# Altium schematic sheet vme_full_bus.SchDoc
size A4
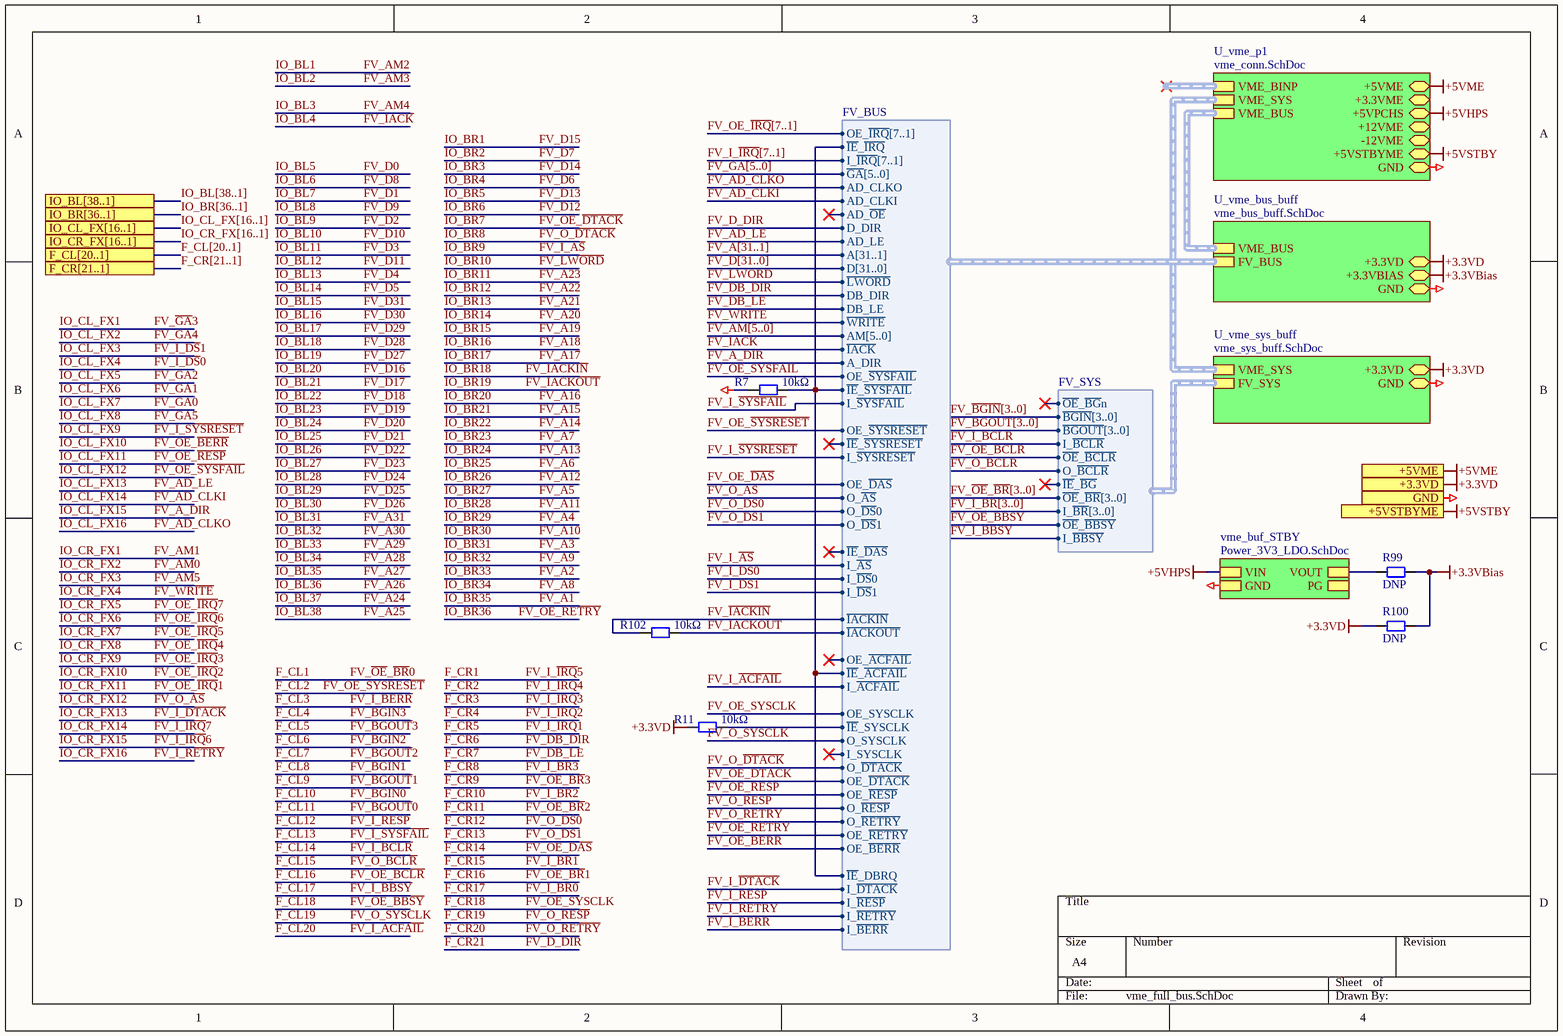
[diagram p0: vme_full_bus.SchDoc]

## Parts
R7  10kΩ  [RESC2012N]
R11  10kΩ  [RESC2012N]
R99  DNP  [RESC2012N]
R100  DNP  [RESC2012N]
R102  10kΩ  [RESC2012N]

## Sub-sheets
U_vme_bus_buff = vme_bus_buff.SchDoc: GND (bidir), +3.3VBIAS (bidir), +3.3VD (bidir), FV_BUS (harness FV_BUS), VME_BUS (harness VME_BUS)
U_vme_p1 = vme_conn.SchDoc: VME_BINP (harness VME_BINP), VME_SYS (harness VME_SYS), +5VSTBYME (bidir), +12VME (bidir), -12VME (bidir), +5VPCHS (bidir), +3.3VME (bidir), VME_BUS (harness VME_BUS), +5VME (bidir), GND (bidir)
U_vme_sys_buff = vme_sys_buff.SchDoc: VME_SYS (harness VME_SYS), +3.3VD (bidir), GND (bidir), FV_SYS (harness FV_SYS)
vme_buf_STBY = Power_3V3_LDO.SchDoc: GND, VOUT, VIN, PG

## Ports
+3.3VD, +5VME, +5VSTBYME, F_CL[20..1], F_CR[21..1], GND, IO_BL[38..1], IO_BR[36..1], IO_CL_FX[16..1], IO_CR_FX[16..1]

## Harnesses
FV_SYS: ~{OE}_~{BG}n, ~{BGIN}[3..0], ~{BGOUT}[3..0], I_~{BCLR}, ~{OE}_~{BCLR}, O_~{BCLR}, ~{IE}_~{BG}, ~{OE}_~{BR}[3..0], I_~{BR}[3..0], ~{OE}_~{BBSY}, I_~{BBSY}
FV_BUS: OE_~{IRQ}[7..1], ~{IE}_~{IRQ}, AD_CLKI, I_~{IRQ}[7..1], DB_DIR, DB_LE, OE_~{SYSFAIL}, ~{WRITE}, AD_LE, AD_~{OE}, ~{IACK}, D_DIR, AD_CLKO, ~{IE}_~{SYSFAIL}, A[31..1], D[31..0], ~{LWORD}, AM[5..0], I_~{SYSFAIL}, OE_~{SYSRESET}, ~{IE}_~{SYSRESET}, I_~{SYSRESET}, ~{IE}_~{DAS}, O_~{DS}1, I_~{DS}1, OE_~{DAS}, O_~{AS}, I_~{AS}, ~{IACKIN}, ~{IACKOUT}, OE_~{ACFAIL}, ~{IE}_~{ACFAIL}, I_~{ACFAIL}, OE_SYSCLK, ~{IE}_SYSCLK, O_SYSCLK, I_SYSCLK, ~{IE}_DBRQ, OE_~{BERR}, I_~{BERR}, OE_~{RESP}, I_~{RESP}, OE_~{DTACK}, O_~{DTACK}, I_~{DTACK}, O_~{DS}0, I_~{DS}0, OE_~{RETRY}, I_~{RETRY}, ~{GA}[5..0], O_~{RESP}, O_~{RETRY}, A_DIR

## Nets
+3.3VBias: R99.2 R100.2 ; sheet U_vme_bus_buff/+3.3VBIAS
+3.3VD: R11.1 R100.1 ; port +3.3VD, sheet U_vme_bus_buff/+3.3VD, sheet U_vme_sys_buff/+3.3VD
+5VHPS: sheet U_vme_p1/+5VPCHS, sheet vme_buf_STBY/VIN
+5VME: port +5VME, sheet U_vme_p1/+5VME
+5VSTBY: port +5VSTBYME, sheet U_vme_p1/+5VSTBYME
GND: R7.1 ; port GND, sheet U_vme_p1/GND, sheet U_vme_bus_buff/GND, sheet U_vme_sys_buff/GND, sheet vme_buf_STBY/GND
F_CL2: sheet U_vme_bus_buff/FV_BUS.OE_~{SYSRESET}  [also labelled FV_OE_~{SYSRESET}]
F_CL3: sheet U_vme_bus_buff/FV_BUS.I_~{BERR}  [also labelled FV_I_~{BERR}]
F_CL12: sheet U_vme_bus_buff/FV_BUS.I_~{RESP}  [also labelled FV_I_~{RESP}]
F_CL13: sheet U_vme_bus_buff/FV_BUS.I_~{SYSFAIL}  [also labelled FV_I_~{SYSFAIL}]
F_CL14: sheet U_vme_sys_buff/FV_SYS.I_~{BCLR}  [also labelled FV_I_~{BCLR}]
F_CL15: sheet U_vme_sys_buff/FV_SYS.O_~{BCLR}  [also labelled FV_O_~{BCLR}]
F_CL16: sheet U_vme_sys_buff/FV_SYS.~{OE}_~{BCLR}  [also labelled FV_~{OE}_~{BCLR}]
F_CL17: sheet U_vme_sys_buff/FV_SYS.I_~{BBSY}  [also labelled FV_I_~{BBSY}]
F_CL18: sheet U_vme_sys_buff/FV_SYS.~{OE}_~{BBSY}  [also labelled FV_~{OE}_~{BBSY}]
F_CL19: sheet U_vme_bus_buff/FV_BUS.O_SYSCLK  [also labelled FV_O_SYSCLK]
F_CL20: sheet U_vme_bus_buff/FV_BUS.I_~{ACFAIL}  [also labelled FV_I_~{ACFAIL}]
F_CR6: sheet U_vme_bus_buff/FV_BUS.DB_DIR  [also labelled FV_DB_DIR]
F_CR7: sheet U_vme_bus_buff/FV_BUS.DB_LE  [also labelled FV_DB_LE]
F_CR12: sheet U_vme_bus_buff/FV_BUS.O_~{DS}0  [also labelled FV_O_~{DS}0]
F_CR13: sheet U_vme_bus_buff/FV_BUS.O_~{DS}1  [also labelled FV_O_~{DS}1]
F_CR14: sheet U_vme_bus_buff/FV_BUS.OE_~{DAS}  [also labelled FV_OE_~{DAS}]
F_CR18: sheet U_vme_bus_buff/FV_BUS.OE_SYSCLK  [also labelled FV_OE_SYSCLK]
F_CR19: sheet U_vme_bus_buff/FV_BUS.O_~{RESP}  [also labelled FV_O_~{RESP}]
F_CR20: sheet U_vme_bus_buff/FV_BUS.O_~{RETRY}  [also labelled FV_O_~{RETRY}]
F_CR21: sheet U_vme_bus_buff/FV_BUS.D_DIR  [also labelled FV_D_DIR]
FV_A_DIR: sheet U_vme_bus_buff/FV_BUS.A_DIR  [also labelled IO_CL_FX15]
FV_AD_CLKI: sheet U_vme_bus_buff/FV_BUS.AD_CLKI  [also labelled IO_CL_FX14]
FV_AD_CLKO: sheet U_vme_bus_buff/FV_BUS.AD_CLKO  [also labelled IO_CL_FX16]
FV_AD_LE: sheet U_vme_bus_buff/FV_BUS.AD_LE  [also labelled IO_CL_FX13]
FV_~{IACK}: sheet U_vme_bus_buff/FV_BUS.~{IACK}  [also labelled IO_BL4]
FV_~{IACKIN}: R102.1 ; sheet U_vme_bus_buff/FV_BUS.~{IACKIN}  [also labelled IO_BR18]
FV_~{IACKOUT}: R102.2 ; sheet U_vme_bus_buff/FV_BUS.~{IACKOUT}  [also labelled IO_BR19]
FV_I_~{AS}: sheet U_vme_bus_buff/FV_BUS.I_~{AS}  [also labelled IO_BR9]
FV_I_~{DS}0: sheet U_vme_bus_buff/FV_BUS.I_~{DS}0  [also labelled IO_CL_FX4]
FV_I_~{DS}1: sheet U_vme_bus_buff/FV_BUS.I_~{DS}1  [also labelled IO_CL_FX3]
FV_I_~{DTACK}: sheet U_vme_bus_buff/FV_BUS.I_~{DTACK}  [also labelled IO_CR_FX13]
FV_I_~{RETRY}: sheet U_vme_bus_buff/FV_BUS.I_~{RETRY}  [also labelled IO_CR_FX16]
FV_I_~{SYSRESET}: sheet U_vme_bus_buff/FV_BUS.I_~{SYSRESET}  [also labelled IO_CL_FX9]
FV_~{LWORD}: sheet U_vme_bus_buff/FV_BUS.~{LWORD}  [also labelled IO_BR10]
FV_O_~{AS}: sheet U_vme_bus_buff/FV_BUS.O_~{AS}  [also labelled IO_CR_FX12]
FV_O_~{DTACK}: sheet U_vme_bus_buff/FV_BUS.O_~{DTACK}  [also labelled IO_BR8]
FV_OE_~{BERR}: sheet U_vme_bus_buff/FV_BUS.OE_~{BERR}  [also labelled IO_CL_FX10]
FV_OE_~{DTACK}: sheet U_vme_bus_buff/FV_BUS.OE_~{DTACK}  [also labelled IO_BR7]
FV_OE_~{RESP}: sheet U_vme_bus_buff/FV_BUS.OE_~{RESP}  [also labelled IO_CL_FX11]
FV_OE_~{RETRY}: sheet U_vme_bus_buff/FV_BUS.OE_~{RETRY}  [also labelled IO_BR36]
FV_OE_~{SYSFAIL}: sheet U_vme_bus_buff/FV_BUS.OE_~{SYSFAIL}  [also labelled IO_CL_FX12]
FV_~{WRITE}: sheet U_vme_bus_buff/FV_BUS.~{WRITE}  [also labelled IO_CR_FX4]
NetR7_2: R7.2 ; sheet U_vme_bus_buff/FV_BUS.~{IE}_~{IRQ}, sheet U_vme_bus_buff/FV_BUS.~{IE}_~{SYSFAIL}, sheet U_vme_bus_buff/FV_BUS.~{IE}_~{ACFAIL}, sheet U_vme_bus_buff/FV_BUS.~{IE}_DBRQ
NetR11_2: R11.2 ; sheet U_vme_bus_buff/FV_BUS.~{IE}_SYSCLK
NetR99_1: R99.1 ; sheet vme_buf_STBY/VOUT

## Buses and harness runs
bus F_CL[20..1] = port F_CL[20..1]
bus F_CR[21..1] = port F_CR[21..1]
bus FV_A[31..1]
bus FV_AM[5..0]
bus FV_D[31..0]
bus FV_I_~{BR}[3..0]
bus FV_I_~{IRQ}[7..1]
bus FV_OE_~{IRQ}[7..1]
bus FV_~{BGIN}[3..0]
bus FV_~{BGOUT}[3..0]
bus FV_~{GA}[5..0]
bus FV_~{OE}_~{BR}[3..0]
bus IO_BL[38..1] = port IO_BL[38..1]
bus IO_BR[36..1] = port IO_BR[36..1]
bus IO_CL_FX[16..1] = port IO_CL_FX[16..1]
bus IO_CR_FX[16..1] = port IO_CR_FX[16..1]
harness sheet U_vme_bus_buff/VME_BUS = sheet U_vme_p1/VME_BUS
harness sheet U_vme_p1/VME_SYS = sheet U_vme_sys_buff/VME_SYS

## Library data of the parts
R7 R11 R102 = RESC: Resistor, Generic, SMD; Pkg: 0805; Maintainer: Evgeniy Kotov; SMD Solders: 2; THD Solders: 0; PartField: 10kΩ; Release Date: 06.03.2017; Last Change Data: 09.03.2017; Value: 10kΩ
R99 R100 = RESC: Resistor, Generic, SMD; PartField: 0Ω; Pkg: 0805; Maintainer: Evgeniy Kotov; SMD Solders: 2; THD Solders: 0; Release Date: 06.03.2017; Last Change Data: 09.03.2017; Value: DNP